# Altium project Popov_diod.PrjPcb
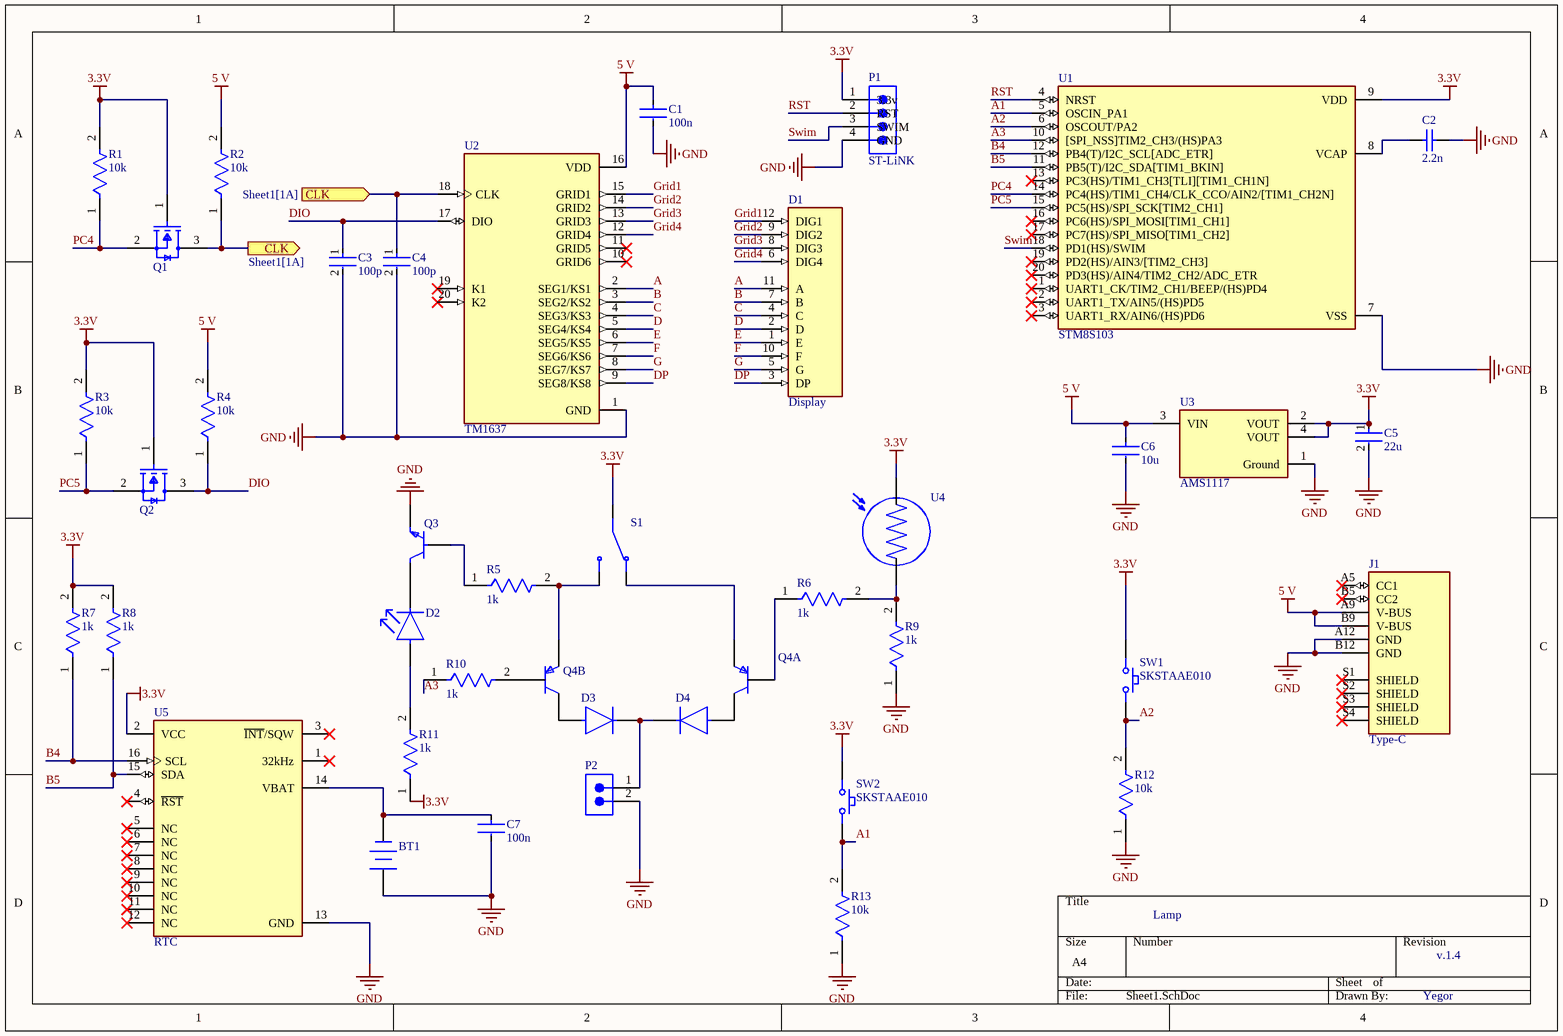
[diagram p0: Sheet1.SchDoc]
1 sheet, 40 parts. Net scope: flat (ports and power ports of the same name join across sheets).
Board file: Diod_Popov.PcbDoc

## Sheet Sheet1.SchDoc
size A4; SheetNumber: 1; SheetTotal: 1

### Parts
BT1  (no value)  [PANA-CR-2032HFN]
C1  100n  [FP-AC1206-0_85-IPC_C]
C2  2.2n  [CAPC1206(3216)150_M]
C3  100p  [FP-1206-L_3_2_0_2-W_1_6_0-IPC_B]
C4  100p  [FP-1206-L_3_2_0_2-W_1_6_0-IPC_B]
C5  22u  [FP-1206-L_3_2_0_2-W_1_6_0-MFG]
C6  10u  [FP-GCJ31C-0_4-MFG]
C7  100n  [FP-AC1206-0_85-IPC_C]
D1  Display  [LED_LDQ-M3604RI]
D2  (no value)  [FP-HLMP-1301-MFG]
D3  (no value)  [FP-425AD-MFG]
D4  (no value)  [FP-425AD-MFG]
J1  Type-C  [CUI_UJC-HP-3-SMT-TR]
P1  ST-LiNK  [61300411021]
P2  (no value)  [SMTC-TSW-102-26-XX-S]
Q1  (no value)  [FP-318-08-MFG]
Q2  (no value)  [FP-318-08-MFG]
Q3  (no value)  [PLZZ0004CA-A_MFG]
Q4  (no value)  [SOT95P280X145-6_P6_064_N]  (parts A,B of 2)
R1  10k  [FP-CRCW1206-e3-IPC_B]
R2  10k  [FP-CRCW1206-e3-IPC_B]
R3  10k  [FP-CRCW1206-e3-IPC_B]
R4  10k  [FP-CRCW1206-e3-IPC_B]
R5  1k  [FP-RP732B-IPC_C]
R6  1k  [FP-RP732B-IPC_C]
R7  1k  [FP-RP732B-IPC_C]
R8  1k  [FP-RP732B-IPC_C]
R9  1k  [FP-RP732B-IPC_C]
R10  1k  [FP-RP732B-IPC_C]
R11  1k  [FP-RP732B-IPC_C]
R12  10k  [FP-CRCW1206-e3-IPC_B]
R13  10k  [FP-CRCW1206-e3-IPC_B]
S1  (no value)  [SW_MINI-SPDT-SW]
SW1  SKSTAAE010  [FP-SKSTAAE010-MFG]
SW2  SKSTAAE010  [FP-SKSTAAE010-MFG]
U1  STM8S103  [SOP65P640X120-20N]
U2  TM1637  [SOIC127P1035X255-20N]
U3  AMS1117  [FP-AMS1117-IPC_A]
U4  (no value)  [XDCR_PDV-P8003]
U5  RTC  [FP-W16-H2-MFG]

### Ports
CLK (in, see Sheet1[1A]), CLK (out, see Sheet1[1A])

### Nets
3.3V: C5.1 P1.1(3.3v) Q1.1(G) Q2.1(G) R1.2 R3.2 R7.2 R8.2 R11.1 S1.2 SW1.1 SW2.1 U1.9(VDD) U3.2(VOUT) U3.4(VOUT) U4.2 U5.2(VCC)
5 V: C1.1 C6.1 J1.A9(V-BUS) J1.B9(V-BUS) R2.2 R4.2 U2.16(VDD) U3.3(VIN)
GND: BT1.1(+) C1.2 C2.2 C3.2 C4.2 C5.2 C6.2 C7.2 J1.A12(GND) J1.B12(GND) P1.4(GND) P2.2 Q3.3(EMITTER) R9.1 R12.1 R13.1 U1.7(VSS) U2.1(GND) U3.1(Ground) U5.13(GND)
A: D1.11(A) U2.2(SEG1/KS1)
A1: R13.2 SW2.2 U1.5(OSCIN_PA1)
A2: R12.2 SW1.2 U1.6(OSCOUT/PA2)
A3: R10.1 U1.10([SPI_NSS]TIM2_CH3/(HS)PA3)
B: D1.7(B) U2.3(SEG2/KS2)
B4: R7.1 U1.12(PB4(T)/I2C_SCL[ADC_ETR]) U5.16(SCL)
B5: R8.1 U1.11(PB5(T)/I2C_SDA[TIM1_BKIN]) U5.15(SDA)
C: D1.4(C) U2.4(SEG3/KS3)
D: D1.2(D) U2.5(SEG4/KS4)
DIO: C3.1 Q2.3(D) R4.1 U2.17(DIO)
DP: D1.3(DP) U2.9(SEG8/KS8)
E: D1.1(E) U2.6(SEG5/KS5)
F: D1.10(F) U2.7(SEG6/KS6)
G: D1.5(G) U2.8(SEG7/KS7)
Grid1: D1.12(DIG1) U2.15(GRID1)
Grid2: D1.9(DIG2) U2.14(GRID2)
Grid3: D1.8(DIG3) U2.13(GRID3)
Grid4: D1.6(DIG4) U2.12(GRID4)
PC4: Q1.2(S) R1.1 U1.14(PC4(HS)/TIM1_CH4/CLK_CCO/AIN2/[TIM1_CH2N])
PC5: Q2.2(S) R3.1 U1.15(PC5(HS)/SPI_SCK[TIM2_CH1])
RST: P1.2(RST) U1.4(NRST)
Swim: P1.3(SWIM) U1.18(PD1(HS)/SWIM)
NetBT1_2: BT1.2(-) C7.1 U5.14(VBAT)
NetC2_1: C2.1 U1.8(VCAP)
NetC4_1: C4.1 Q1.3(D) R2.1 U2.18(CLK) ; port CLK
NetD2_1: D2.1(C) Q3.2(COLLECTOR)
NetD2_2: D2.2(A) R11.2
NetD3_1: D3.1(C) D4.1(C) P2.1
NetD3_2: D3.2(A) Q4.3(2_COLLECTOR)
NetD4_2: D4.2(A) Q4.6(1_COLLECTOR)
NetQ3_1: Q3.1(BASE) R5.1
NetQ4_1: Q4.1(1_BASE) R6.1
NetQ4_2: Q4.2(1_EMITTER) S1.1
NetQ4_4: Q4.4(2_BASE) R10.2
NetQ4_5: Q4.5(2_EMITTER) R5.2 S1.3
NetR6_2: R6.2 R9.2 U4.1

Not connected (* = marked no-connect by the designer): J1 A5(CC1)* B5(CC2)* S1(SHIELD)* S2(SHIELD)* S3(SHIELD)* S4(SHIELD)*; U1 1(UART1_CK/TIM2_CH1/BEEP/(HS)PD4)* 2(UART1_TX/AIN5/(HS)PD5)* 3(UART1_RX/AIN6/(HS)PD6)* 13(PC3(HS)/TIM1_CH3[TLI][TIM1_CH1N])* 16(PC6(HS)/SPI_MOSI[TIM1_CH1])* 17(PC7(HS)/SPI_MISO[TIM1_CH2])* 19(PD2(HS)/AIN3/[TIM2_CH3])* 20(PD3(HS)/AIN4/TIM2_CH2/ADC_ETR)*; U2 10(GRID6)* 11(GRID5)* 19(K1)* 20(K2)*; U5 1(32kHz)* 3(~{INT}/SQW)* 4(~{RST})* 5(NC)* 6(NC)* 7(NC)* 8(NC)* 9(NC)* 10(NC)* 11(NC)* 12(NC)*

### Notes on the sheet
- Lamp
- v.1.4
- Yegor

### Library data of the parts
BT1 = CMP-2000-05296-1: Coin Cell Battery, 225 mAh, 0.2 mA, 3 V, -30 to 60 degC, Bulk; Manufacturer: Panasonic; SVHC: 1,2-dimethoxyethane,ethyleneglycoldimethylether(EGDME)(15-Jun-2015); Battery Size Code: 2032; Battery Voltage: 3V; Battery IEC Code: CR2032; Battery NEDA Code: 5004LC; External Height: 3.2mm; Battery Terminals: PCBPins; Battery Capacity: 220mAh; External Diameter: 20mm; Battery Technology: LithiumManganeseDioxide; Product Range: -; Datasheet Version: Rev. 0, 05/2010; Manufacturer URL: http://www.panasonic.com/; External Depth: -; Weight: 2.9g; Datasheet URL: https://datasheet.ciiva.com/3/aaa4000de87-3072.pdf; External Width: -
C1 C7 = CMP-03422-001145-1: CAP CER 0.1UF 100V X7R 1206; Manufacturer Part Number: AC1206KKX7R0BB104; Manufacturer: Yageo; Material: Ceramic; Temperature Coefficient: 15%; Tolerance: 0.1; Automotive Grade: Grade 1; Value: 100 nF; Category: Cap; Temperature Characteristic: X7R; Height: 0.95mm; Automotive: Yes; Digikey Description: CAP CER 0.1UF 100V X7R 1206; Voltage Rating: 100 V; Octopart: https://octopart.com/ac1206kkx7r0bb104-yageo-75666120; ComponentLink2URL: http://www.yageo.com/documents/recent/UPY-AC_NP0X7R_16V-to-630V_12.pdf; Device Class L1: Passive Components; ComponentLink2Description: Datasheet; Footprint Url: http://www.yageo.com/exep/pages/download/literatures/UPY-C_GEN_24.pdf; Lead Free: Yes; Ipc Land Pattern Name: CAPC320160X85; Device Class L3: Ceramic Capacitors; Device Class L2: Capacitors; Capacitance: 100 nF; RoHS: TRUE; Temperature Range Low: -55°C; Temperature: -55°C to +125°C; Temperature Range High: +125°C; Package: AC1206-0.85
C2 = CMP-1037-02796-1: CAP 2.2nF 100V ±1% 1206 (3216 Metric) Thickness 1.5mm SMD; Case-Metric: 3216; Tolerance: Â±1%; Case-EIA: 1206; Technology: SMT; Rated Voltage: 100 V; Value: 2.2nF; Max Thickness: 1.5 mm
C3 C4 = CMP-04427-007664-1: General Purpose Ceramic Capacitor, 1206, 100pF, 5%, NP0, 30ppm/°C, 100V; Dielectric: C0G; Insulation Resistance: 100GR; Voltage: 63V; Max Operating Temperature: 125°C; Termination: SMD/SMT; Radiation Hardening: No; Capacitance: 100pF; Voltage Rating: 100V; Thickness: 0.037inch; Temperature Coefficient: 30ppm/°C; Mount: Surface Mount; REACH SVHC: No SVHC; Case Code (Imperial): 1206; Voltage Rating (DC): 100V; Lead Free: Lead Free; RoHS Compliant: Yes; Height: 0.94mm; Number of Pins: 2; Case/Package: 1206; Package Quantity: 1; Series: -; Construction: Flat; Contact Plating: Tin; Tolerance: 5%; Length: 3.2mm; Min Operating Temperature: -55°C; Width: 0.063inch; Packaging: Tape and Reel; Case Code (Metric): 3216; Depth: 1.6mm
C5 = CMP-04427-006376-1: General Purpose Ceramic Capacitor, 1206, 22uF, 10%, X5R, 15%, 6.3V; Insulation Resistance: 100GR; Dissipation Factor: 5%; Series: 1206; REACH SVHC: No SVHC; Depth: 1.6mm; Dielectric: X5R; Contact Plating: Tin; Lead Free: Lead Free; Voltage Rating (DC): 6.3V; Termination: SMD/SMT; Case/Package: 1206; Capacitance: 22uF; Max Operating Temperature: 85°C; Length: 3.2mm; Voltage Rating: 6.3V; Radiation Hardening: No; Width: 1.6mm; Package Quantity: 1; RoHS Compliant: Yes; Mount: Surface Mount; Construction: Flat; Case Code (Metric): 3216; Dielectric Material: Ceramic; Thickness: 0.07inch; Min Operating Temperature: -55°C; Tolerance: 10%; Height: 0.07mm; Voltage: 6.3V; Number of Pins: 2; Packaging: Tape and Reel; Case Code (Imperial): 1206
C6 = CMP-06035-004889-1: Cap Ceramic 10uF 35V X7T 10% SMD 1206 +125°C Embossed Plastic T/R
D1 = LDQ-M3604RI: Display, Seven Segment, 9.2MM, Red; MF: Lumex; SnapEDA_Link: https://www.snapeda.com/parts/LDQ-M3604RI/Lumex/view-part/?ref=snap; Package: None; Value: *; MP: LDQ-M3604RI; Check_prices: https://www.snapeda.com/parts/LDQ-M3604RI/Lumex/view-part/?ref=eda
D2 = CMP-18399-000007-1: LED RED DIFFUSED T-1 T/H; Manufacturer: Broadcom; Forward Current: 10mA; Max Junction Temp: +110°C; Wavelength: 626nm; Led Orientation: Straight; Viewing Angle: 60°; Luminous Intensity: 3.4mcd; Forward Voltage: 1.9V; Reverse Voltage: 5V; Peak Emmision Wavelength: 635nm; Mouser Description: Standard LEDs - Through Hole Red Diffused 635nm 3.4mcd; RoHS: TRUE; ComponentLink2Description: Datasheet; Device Class L1: Optoelectronics; Temperature Range High: +100°C; Manufacturer Part Number: HLMP-1301; ComponentLink2URL: https://docs.broadcom.com/docs/AV02-1555EN; Colour: Red; Digikey Description: LED RED DIFFUSED T-1 T/H; Automotive: No; Device Class L2: LEDs; Temperature Range Low: -40°C; Octopart: https://octopart.com/hlmp-1301-broadcom-71130345; Category: Diode; Lead Free: Yes; Device Class L3: unset; Package: 0; Temperature: -40°C to +100°C
D3 D4 = CMP-00278-84331277-1: S1JFL Rectifier Diode, 1 Phase, 1 Element, 1A, 600V V(RRM), Silicon; Manufacturer Lifecycle Status: ACTIVE, NOT REC; Max Forward Surge Current (Ifsm): 30A; Element Configuration: Single; Reverse Recovery Time: 2µs; Schedule B: 8541100080, 8541100080|8541100080, 8541100080|8541100080|8541100080, 8541100080|8541100080|8541100080|8541100080; Max Repetitive Reverse Voltage (Vrrm): 600V; Average Rectified Current: 1A; Max Reverse Voltage (DC): 600V; Min Operating Temperature: -50°C; Weight: 27.6mg; Mount: Surface Mount; Forward Current: 1A; Max Operating Temperature: 150°C; Lifecycle Status: NRND; NexarPartId: 84331277; RoHS: Compliant
J1 = UJC-HP-3-SMT-TR: Package: None; Price: None; Value: *; MP: UJC-HP-3-SMT-TR; Availability: Unavailable
P1 = CMP-1502-01063-3: NexarPartId: 31153320; Current Rating: 3A; Number of Contacts: 4; Gender: Male; Operating Supply Voltage: 250V; Contact Resistance: 20mΩ; Connector Type: Male Pin; Pitch: 2.54mm; Contact Material: Copper; Number of Positions: 4; Color: Black; Contact Plating: Gold; Number of Pins: 4; Termination: Solder; Number of Rows: 1; Lead Pitch: 2.54mm; Mount: Through Hole; Contact Mating Length: 5.9944mm; RoHS: Compliant; REACH SVHC: Unknown
P2 = CMP-1024-00327-1: 0.025" SQ Post Header, Through-hole, Vertical, -55 to 125 degC, 2.54 mm Pitch, 2-Pin, Male, RoHS; PartNumber: TSW-102-26-G-S; Manufacturer: Samtec; Pitch: 2.54 mm; Orientation: Vertical; ComponentLink3Description: Package Specification; PackageReference: TSW-102-26-XX-S; Mounting Technology: Through-hole; ComponentLink2Description: Datasheet; ComponentLink1URL: http://www.samtec.com; DatasheetVersion: F-214; ComponentLink1Description: Manufacturer URL; RoHS: True; ComponentLink2URL: http://www.samtec.com/documents/webfiles/pdf/TSW_TH.PDF; ComponentLink3URL: http://www.samtec.com/documents/webfiles/cpdf/TSW-XXX-XX-XXX-X-XX-XXX-MKT.pdf; PackageDescription: .025[0.64] SQ. Post Terminal Strip Assembly; PackageVersion: DM, 8/1988; Temperature Range: -55 to 125 degC
Q1 Q2 = CMP-07173-000101-1: MOSFET N-CH 50V 220MA SOT-23; Turn-Off Delay Time: 20ns; Element Configuration: Single; Rds On Max: 3.5R; Gate to Source Voltage (Vgs): 20V; Threshold Voltage: 1.3V; Number of Elements: 1; Power Dissipation: 360mW; Rise Time: 9ns; Turn-On Delay Time: 2.5ns; Input Capacitance: 27pF; On-State Resistance: 6R; Lead Free: Lead Free; Length: 2.92mm; Width: 1.3mm; Drain to Source Breakdown Voltage: 50V; Min Operating Temperature: -55°C; REACH SVHC: No SVHC; Packaging: Tape and Reel; Radiation Hardening: No; Height: 0.93mm; Drain to Source Voltage (Vdss): 50V; Current Rating: 220mA; Voltage Rating (DC): 50V; Weight: 0.03g; Continuous Drain Current (ID): 220mA; Number of Pins: 3; Nominal Vgs: 1.3V; Max Power Dissipation: 360mW; Fall Time: 9ns; Drain to Source Resistance: 3.5R; Contact Plating: Tin; Case/Package: SOT-23; Package Quantity: 1; Dual Supply Voltage: 50V; Mount: Surface Mount; Termination: SMD/SMT; Max Operating Temperature: 150°C
Q3 = CMP-00572-18697870-1: Trans GP BJT NPN 50V 1A 4-Pin(3+Tab) UPAK T/R; Manufacturer Lifecycle Status: OBSOLETE; Number of Elements: 1; Collector Base Voltage (VCBO): 100V; Frequency: 100MHz; Emitter Base Voltage (VEBO): 6V; Power Dissipation: 1W; Lead Free: Lead Free; ComponentLink1Description: Manufacturer's Website; Max Operating Temperature: 150°C; ComponentLink3URL: https://www.renesas.com/en/document/psc/package-drawing-upak-4pin-plzz0004ca; ComponentLink1URL: http://www.renesas.com; Number of Pins: 4; Min Operating Temperature: -55°C; HelpURL: https://octopart.com/cad-content/api/get-model-datasheet/15189/18697870; RoHS: Compliant; Height: 1.6mm; Lifecycle Status: Obsolete; ComponentLink2URL: https://octopart.com/cad-content/api/get-model-datasheet/15189/18697870; Radiation Hardening: No; Collector Emitter Voltage (VCEO): 50V; ComponentLink2Description: Datasheet URL; Polarity: NPN; Mount: Through Hole; ComponentLink3Description: Manufacturer's Package Drawing; Packaging: Tape and Reel; China RoHS: Compliant
Q4 = CMP-00572-88253858-3: Transistor, Bjt, Pair, Pnp, 11V V(Br)Ceo, 14Ma I(C), So; Manufacturer Lifecycle Status: ACTIVE; Frequency: 7GHz; Max Collector Current: 26mA; Emitter Base Voltage (VEBO): 4.5V; Collector Base Voltage (VCBO): 12V; Element Configuration: Dual; Collector Emitter Breakdown Voltage: 9V; Noise Figure: 2.6dB; Pitch: 1mm; ComponentLink3URL: https://www.renesas.com/en/document/psc/package-drawing-sot23-6pin-p6064; Height: 0m; HelpURL: https://octopart.com/cad-content/api/get-model-datasheet/15189/88253858; Lifecycle Status: Production; Length: 2.9mm; RoHS: Compliant; Current Rating: 14mA; ComponentLink1URL: http://www.renesas.com; ComponentLink2URL: https://octopart.com/cad-content/api/get-model-datasheet/15189/88253858; Max Frequency: 7GHz; Transition Frequency: 7GHz; Schedule B: 8542330000; Case/Package: SOT-23-6; Export Control Classification Number (ECCN) Code: EAR99; Lead Free: Lead Free; Number of Pins: 6; Continuous Collector Current: 26mA; Min Operating Temperature: -40°C; ComponentLink2Description: Datasheet URL; Polarity: PNP; Voltage Rating (DC): 11V; Width: 1.7mm; ComponentLink1Description: Manufacturer's Website; ComponentLink3Description: Manufacturer's Package Drawing; Max Operating Temperature: 85°C; Radiation Hardening: No; Mount: Surface Mount; Gain Bandwidth Product: 7GHz; Collector Emitter Voltage (VCEO): 11V
R1-R4 R12 R13 = CMP-02407-011266-1: Res MC AT Professional Thin Film 1206 10kΩ 0.5% 0.4W ±25ppm/°C Molded Paper T/R; Resistance: 10kR; Voltage Rating: 200V; Max Power Dissipation: 400mW; Weight: 0.000325oz; Height: 0.55mm; Case Code (Imperial): 1206; Packaging: Tape and Reel; Series: MCA AT - Professional; Width: 1.6mm; Resistor Type: Thin Film; Tolerance: 0.5%; Max Operating Temperature: 175°C; Termination: SMD/SMT; Min Operating Temperature: -55°C; Temperature Coefficient: 25ppm/°C; Number of Terminations: 2; Length: 3.2mm; RoHS Compliant: Yes; Case Code (Metric): 3216; Case/Package: 1206; Features: Automotive AEC-Q200; Power Rating: 400mW
R5-R11 = CMP-03211-008960-1: Res Thin Film 1206 1.0KΩ 0.1% 0.25W 15ppm/°C Molded SMD; Manufacturer: TE Connectivity; Manufacturer Part Number: RP73D2B1K0BTG; Voltage Rating: 200V; Octopart: https://octopart.com/rp73d2b1k0btg-te+connectivity-42012461; Ipc Land Pattern Name: RESC305155X55; ComponentLink2Description: Datasheet; Temperature Range High: 155°C; Series: RP73; Device Class L3: Chip SMD Resistors; Resistance: 1.0KΩ; Value: 1.0KΩ; Device Class L2: Resistors; Temperature Coefficient: 15ppm/°C; Temperature Range Low: -55°C; Device Class L1: Passive Components; Height: 0.65mm; Automotive: No; Package: RP732B; RoHS: TRUE; Tolerance: 0.1%; octopart_url: https://octopart.com/rp73d2b1k0btg-te+connectivity-42012461; packaging: 250 cut tape length; Temperature: -55°C to 155°C; Power Rating: 0.25W; Category: Res; Lead Free: Yes; ComponentLink2URL: https://www.te.com/commerce/DocumentDelivery/DDEController?Action=showdoc&DocId=Data+Sheet%7F1773272%7FL%7Fpdf%7FEnglish%7FENG_DS_1773272_L.pdf%7F8-1879255-6; Composition: Thin Film
S1 = MINI-SPDT-SW: Simple breadboard friendly SPDT slide switch. Rated at 30V/200mA with operating force of 250 +/-100gf.; Availability: Unavailable; Package: None; MP: MINI-SPDT-SW; Value: *; Price: None
SW1 SW2 = CMP-24311-000002-1: Tactile Switches Quiet 0.9mm Middle Stroke, 4N,500KCycle; Lead Free: Lead Free
U1 = STM8S103F3P6: STM8 series Microcontroller IC 8-Bit 16MHz 8KB (8K x 8) FLASH 20-TSSOP; MF: STMicroelectronics; SnapEDA_Link: https://www.snapeda.com/parts/STM8S103F3P6/STMicroelectronics/view-part/?ref=snap; Package: TSSOP-20 STMicroelectronics; Value: *; MP: STM8S103F3P6; Check_prices: https://www.snapeda.com/parts/STM8S103F3P6/STMicroelectronics/view-part/?ref=eda
U2 = TM1637_SOP20: LED Drive Control Special Circuit; MF: Titan Micro Electronics; SnapEDA_Link: https://www.snapeda.com/parts/TM1637_SOP20/Titan+Micro+Electronics/view-part/?ref=snap; Package: Package; Value: *; MP: TM1637_SOP20; Check_prices: https://www.snapeda.com/parts/TM1637_SOP20/Titan+Micro+Electronics/view-part/?ref=eda
U3 = CMP-209535-000001-1: LDO Voltage Regulators 1A, 3.3V; Manufacturer Part Number: AMS1117-3.3; Manufacturer: Advanced Monolithic Systems; Dropout Voltage: 1.1V; Output Type: Fixed; Nominal Supply Current: 5mA; Max Power Dissipation: 1.2W; Max Supply Voltage: 15V; Number Of Outputs: 1; Standoff Height: 0.64mm; Max Junction Temp: +125°C; Height: 1.8mm; Package: AMS1117; Device Class L2: Power Management ICs; ComponentLink2Description: Datasheet; ComponentLink2URL: http://www.advanced-monolithic.com/pdf/ds1117.pdf; Category: IC; RoHS: TRUE; Automotive: No; Device Class L1: Integrated Circuits (ICs); Output Current: 1A; Device Class L3: Voltage Regulators - Linear; Temperature: -40°C to +125°C; Output Voltage: 3.3V; Temperature Range Low: -40°C; Octopart: https://octopart.com/ams1117-3.3-advanced+monolithic+systems-25899300; Lead Free: Yes; Ipc Land Pattern Name: SOT229P700X180-4; Temperature Range High: +125°C
U4 = PDV-P8003: CdS Cells 520nm 16 ~ 33kOhms @ 10 lux; MF: Advanced Photonix; SnapEDA_Link: https://www.snapeda.com/parts/PDV-P8003/Advanced+Photonix/view-part/?ref=snap; Package: Radial Advanced Photonix; Value: *; MP: PDV-P8003; Check_prices: https://www.snapeda.com/parts/PDV-P8003/Advanced+Photonix/view-part/?ref=eda
U5 = CMP-0254-00375-2: IC RTC CLK/CALENDAR I2C 16-SOIC; Operating Supply Voltage: 3.3V; Max Supply Voltage: 5.5V; Logic Function: Clock; Time Format: HH:MM:SS; Date Format: YY-MM-DD-dd; Min Supply Voltage: 2.3V; Min Operating Temperature: -40°C; Packaging: Tape and Reel; Radiation Hardening: No; Package Quantity: 1000; Case/Package: SOIC; Max Operating Temperature: 85°C; Lead Free: Lead Free; Interface: I2C; Contact Plating: Tin; Number of Pins: 16; Mount: Surface Mount